# EAGLE design Zesilovač (EAGLE 8.6.1)
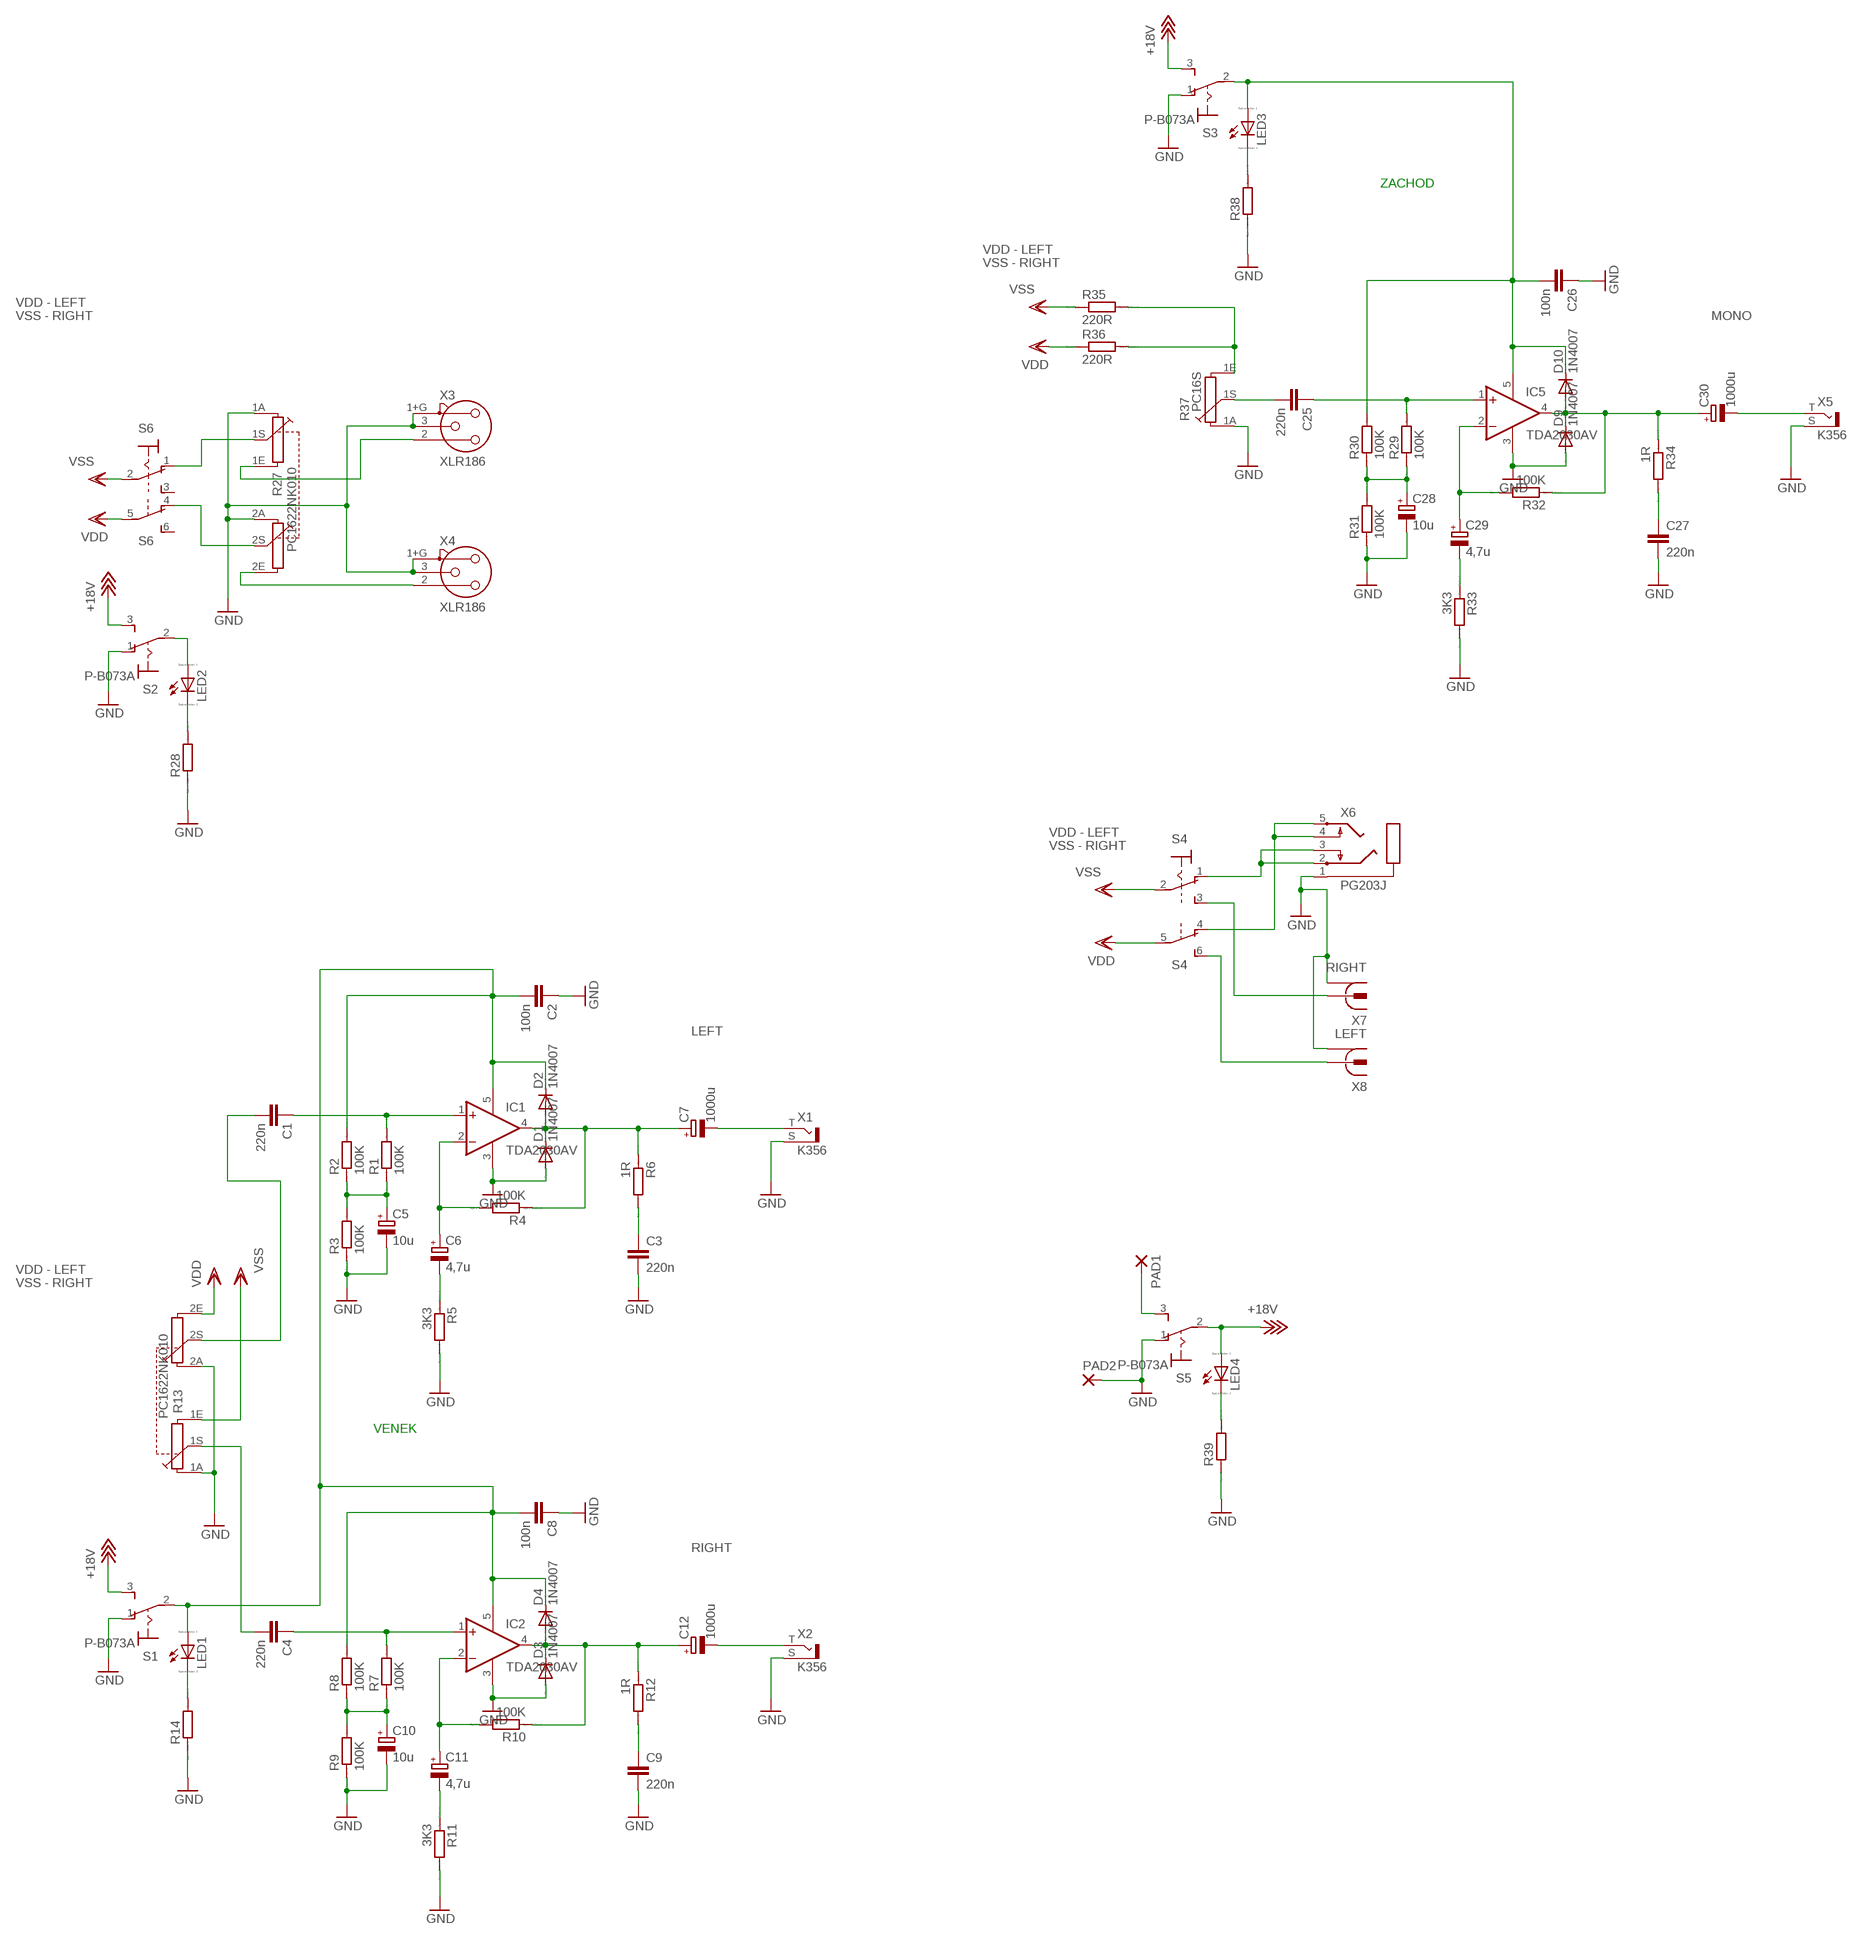
[diagram p0: schematic, sheet 1]

## Parts
C1  220n  C5/2.5  [C5B2.5]
C2  100n  C5/2.5  [C5B2.5]
C3  220n  C5/2.5  [C5B2.5]
C4  220n  C5/2.5  [C5B2.5]
C5  10u  CPOL-EUE2-4  [E2-4]
C6  4,7u  CPOL-EUE2.5-6  [E2,5-6]
C7  1000u  CPOL-EUE3.5-8  [E3,5-8]
C8  100n  C5/2.5  [C5B2.5]
C9  220n  C5/2.5  [C5B2.5]
C10  10u  CPOL-EUE2-4  [E2-4]
C11  4,7u  CPOL-EUE2.5-6  [E2,5-6]
C12  1000u  CPOL-EUE3.5-8  [E3,5-8]
C25  220n  C5/2.5  [C5B2.5]
C26  100n  C5/2.5  [C5B2.5]
C27  220n  C5/2.5  [C5B2.5]
C28  10u  CPOL-EUE2-4  [E2-4]
C29  4,7u  CPOL-EUE2.5-6  [E2,5-6]
C30  1000u  CPOL-EUE3.5-8  [E3,5-8]
D1  1N4007  1N4004  [DO41-10]
D2  1N4007  1N4004  [DO41-10]
D3  1N4007  1N4004  [DO41-10]
D4  1N4007  1N4004  [DO41-10]
D9  1N4007  1N4004  [DO41-10]
D10  1N4007  1N4004  [DO41-10]
IC1  TDA2030AV  TDA2003V  [CB360]
IC2  TDA2030AV  TDA2003V  [CB360]
IC5  TDA2030AV  TDA2003V  [CB360]
LED1  LED_ELD260  [LED_LD260]
LED2  LED_ELD260  [LED_LD260]
LED3  LED_ELD260  [LED_LD260]
LED4  LED_ELD260  [LED_LD260]
PAD1  3,81/1,4  [3,81/1,4]
PAD2  3,81/1,4  [3,81/1,4]
R1  100K  R0204/7  [0204/7]
R2  100K  R0204/7  [0204/7]
R3  100K  R0204/7  [0204/7]
R4  100K  R0204/7  [0204/7]
R5  3K3  R0204/7  [0204/7]
R6  1R  R0207/10  [0207/10]
R7  100K  R0204/7  [0204/7]
R8  100K  R0204/7  [0204/7]
R9  100K  R0204/7  [0204/7]
R10  100K  R0204/7  [0204/7]
R11  3K3  R0204/7  [0204/7]
R12  1R  R0207/10  [0207/10]
R13  PC1622NK010  PC16D  [PC16D]
R14  R0204/7  [0204/7]
R27  PC1622NK010  PC16D  [PC16D]
R28  R0204/7  [0204/7]
R29  100K  R0204/7  [0204/7]
R30  100K  R0204/7  [0204/7]
R31  100K  R0204/7  [0204/7]
R32  100K  R0204/7  [0204/7]
R33  3K3  R0204/7  [0204/7]
R34  1R  R0207/10  [0207/10]
R35  220R  R0204/7  [0204/7]
R36  220R  R0204/7  [0204/7]
R37  PC16S  [PC16S]
R38  R0204/7  [0204/7]
R39  R0204/7  [0204/7]
S1  P-B073A  320-916  [320-916]
S2  P-B073A  320-916  [320-916]
S3  P-B073A  320-916  [320-916]
S4  320-938  [320-938]
S5  P-B073A  320-916  [320-916]
S6  320-938  [320-938]
X1  K356  RC-5231  [RC-5231]
X2  K356  RC-5231  [RC-5231]
X3  XLR186  MC3FAV1-0  [NC3FAV1-0]
X4  XLR186  MC3FAV1-0  [NC3FAV1-0]
X5  K356  RC-5231  [RC-5231]
X6  PG203J  [PG203J]
X7  RIGHT  736880-49  [736880-49]
X8  LEFT  736880-49  [736880-49]

## Nets
+18V: LED4.A S1.3(S) S2.3(S) S3.3(S) S5.2(P)
GND: C2.1 C3.2 C5.- C8.1 C9.2 C10.- C26.1 C27.2 C28.- D1.A D3.A D9.A IC1.3(GND) IC2.3(GND) IC5.3(GND) PAD2.1(P) R3.1 R5.2 R9.1 R11.2 R13.1A R13.2A R14.1 R27.1A R27.2A R28.1 R31.1 R33.2 R37.1A R38.1 R39.1 S1.1(O) S2.1(O) S3.1(O) S5.1(O) X1.S X2.S X3.1+G X3.3 X4.1+G X4.3 X5.S X6.1 X7.1 X7.1@1 X7.1@2 X8.1 X8.1@1 X8.1@2
N$1: C1.1 IC1.1(+IN) R1.2
N$2: C7.+ D1.C D2.A IC1.4(OUT) R4.1 R6.1
N$3: C5.+ R1.1 R2.1 R3.2
N$4: C4.1 IC2.1(+IN) R7.2
N$5: C6.- R5.1
N$6: C6.+ IC1.2(-IN) R4.2
N$7: C3.1 R6.2
N$8: C10.+ R7.1 R8.1 R9.2
N$9: C11.- R11.1
N$10: C11.+ IC2.2(-IN) R10.2
N$11: C12.+ D3.C D4.A IC2.4(OUT) R10.1 R12.1
N$12: C9.1 R12.2
N$13: C1.2 R13.2S
N$14: C4.2 R13.1S
N$15: R27.1S S6.1(1:O)
N$16: C25.2 R37.1S
N$17: R27.2S S6.4(B:O)
N$18: LED3.K(C) R38.2
N$19: C7.- X1.T
N$20: C12.- X2.T
N$21: LED1.K(C) R14.2
N$22: R27.1E X3.2
N$23: R27.2E X4.2
N$39: LED2.K(C) R28.2
N$40: C25.1 IC5.1(+IN) R29.2
N$41: C28.+ R29.1 R30.1 R31.2
N$42: C29.- R33.1
N$43: C29.+ IC5.2(-IN) R32.2
N$44: C30.+ D9.C D10.A IC5.4(OUT) R32.1 R34.1
N$45: C27.1 R34.2
N$46: R35.2 R36.2 R37.1E
N$47: S4.1(1:O) X6.2 X6.3
N$48: C30.- X5.T
N$49: PAD1.1(P) S5.3(S)
N$50: S4.4(B:O) X6.4 X6.5
N$54: S4.3(1:S) X7.2
N$55: S4.6(B:S) X8.2
N$57: LED4.K(C) R39.2
N$68: LED2.A S2.2(P)
VCC1: C2.2 C8.2 D2.C D4.C IC1.5(V+) IC2.5(V+) LED1.A R2.2 R8.2 S1.2(P)
VCC3: C26.2 D10.C IC5.5(V+) LED3.A R30.2 S3.2(P)
VDD: R13.2E R36.1 S4.5(B:P) S6.5(B:P)
VSS: R13.1E R35.1 S4.2(1:P) S6.2(1:P)
Unconnected: S6.3(1:S) S6.6(B:S)

## Notes on the sheet
- ZACHOD
- VDD - LEFT
- VSS - RIGHT
- VDD - LEFT
- VSS - RIGHT | MONO
- VDD - LEFT
- VSS - RIGHT
- LEFT
- VDD - LEFT
- VSS - RIGHT
- VENEK
- RIGHT

## Library data of the parts
C1-C4 C8 C9 C25-C27 = capacitor-wima:C: CAPACITOR naming: grid - package width
C5-C7 C10-C12 C28-C30 = rcl:CPOL-EU: POLARIZED CAPACITOR, European symbol; SPICEPREFIX: C
D1-D4 D9 D10 = diode:1N4004: DIODE general purpose rectifier, 1 A
IC1 IC2 IC5 = linear:TDA2003: AUDIO AMPLIFIER
LED1-LED4 = eagle-ltspice:LED_E: LED Source: http://www.osram.convergy.de Source: www.luxeon.com Source: www.kingbright.com; SPICEMODEL: NONE; SPICEPREFIX: D; SPICETYPE: diode
PAD1 PAD2 = wirepad:3,81/1,4: THROUGH-HOLE PAD
R1-R12 R14 R28-R36 R38 R39 = eagle-ltspice:R: RESISTOR, European symbol; SPICEMODEL: NONE; SPICEPREFIX: R
R13 R27 = piher:PC16D: POTENTIOMETER tandem carbon potentiometer, 16 mm, S3ROH; OC_FARNELL: 4453049; OC_NEWARK: unknown
R37 = piher:PC16S: POTENTIOMETER single carbon potentiometer, 16 mm, S3ROH; OC_FARNELL: 4452940; OC_NEWARK: unknown
S1-S3 S5 = switch:320-916: TOGGLE SWITCH distributor RS Components
S4 S6 = switch:320-938: TOGGLE SWITCH distributor RS Components
X1 X2 X5 = con-lumberg:RC-5231: RCA connectors according to JEITA RC-5231 RCA-Steckverbinder nach JEITA RC-5231 Source: RCA- Stecker 2poolig.pdf
X3 X4 = con-neutrik_ag:MC3?: Neutrik Audio Connector XLR SERIES Stereo 1/4" jack Source: www.neutrik.com/; OC_FARNELL: unknown; OC_NEWARK: unknown
X6 = con-hirschmann:PG203J: MIC/HEADPHONE JACK KS-S stereo microphone/headphone jack PG203JN (Schukat); OC_FARNELL: unknown; OC_NEWARK: unknown
X7 X8 = con-conrad:736880-49: Cinch Connector ( RCA Jack ) Cinch-Einbaukupplung 90º 72345 Vernickelt BKL Electronic Source: Conrad <http://www.conrad.de/ce/de/product/736880>

## Board
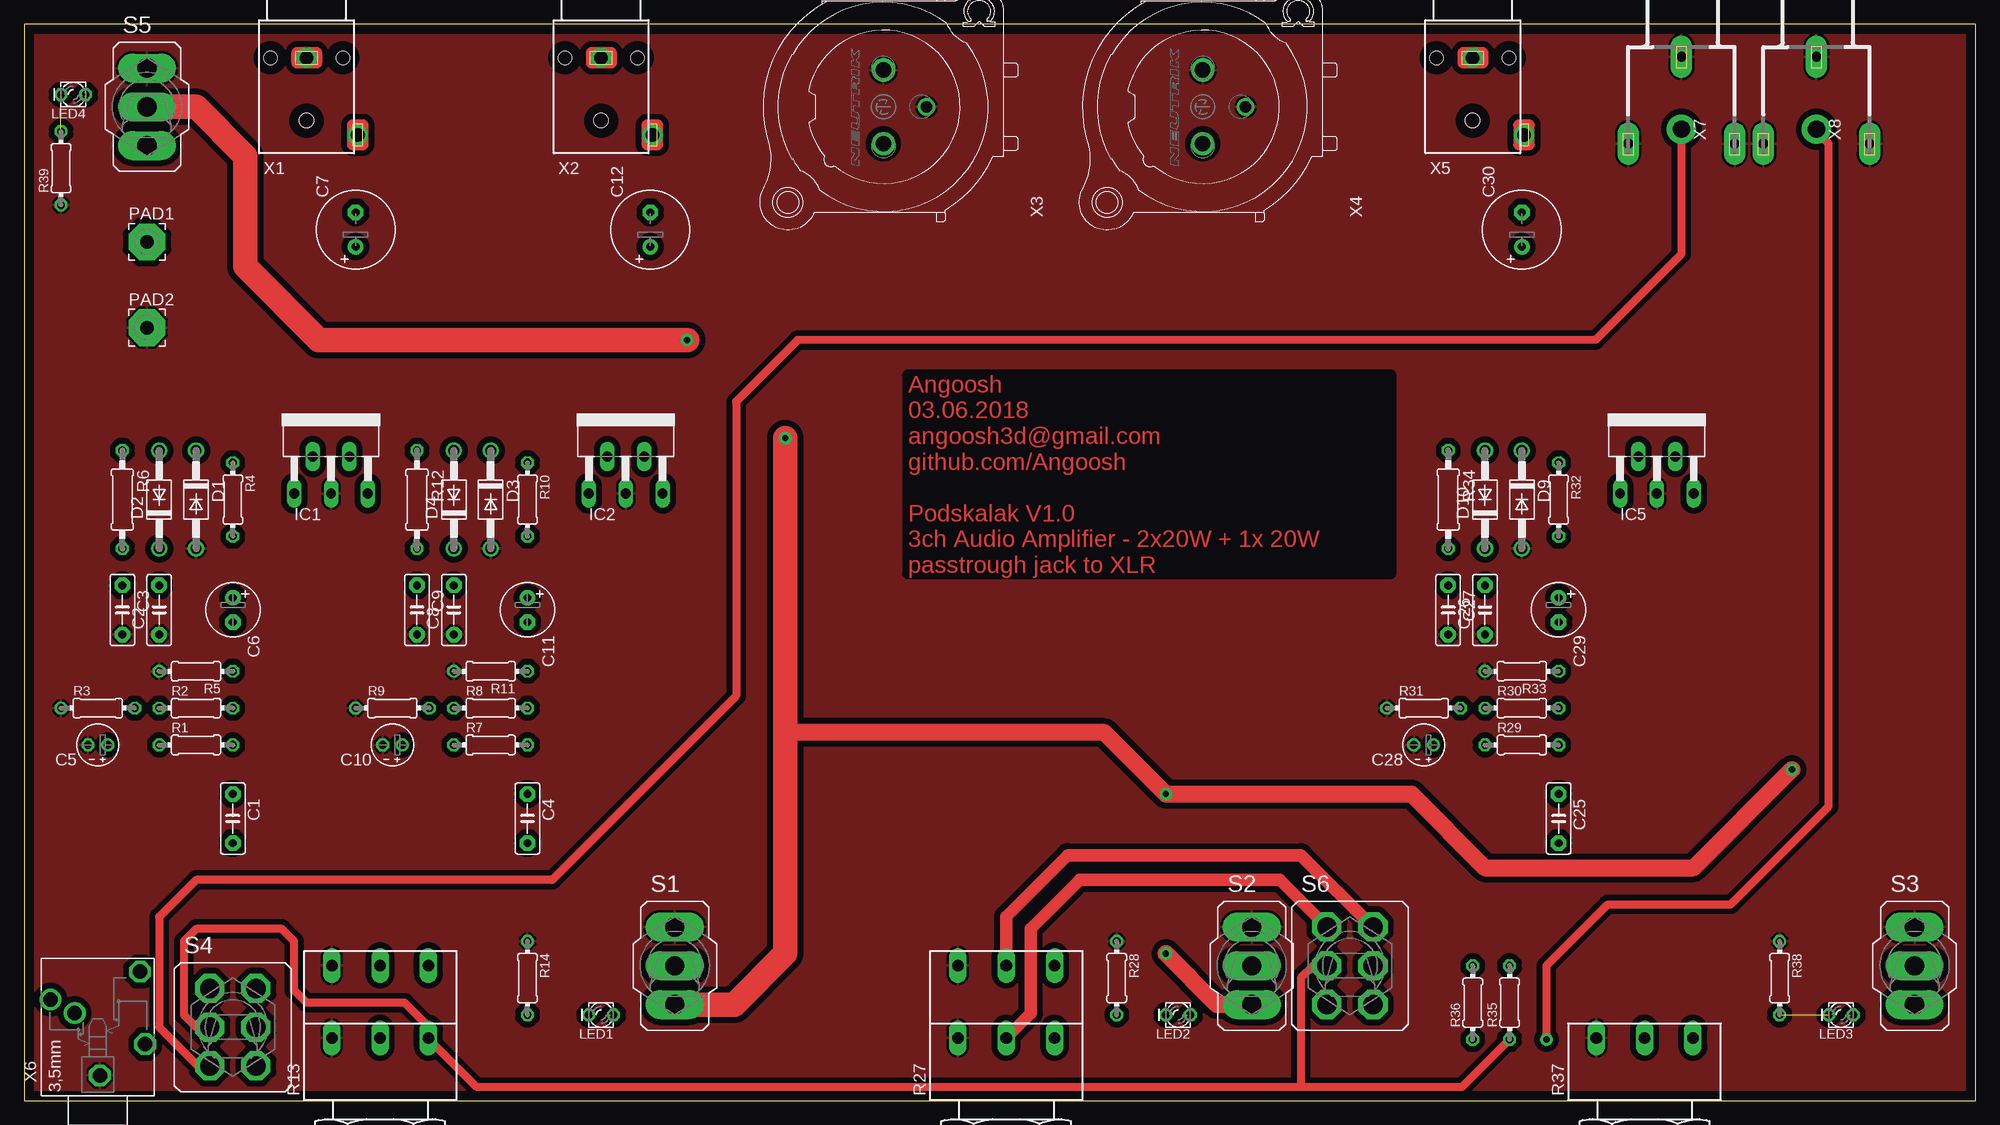
[diagram p1: board, top side]
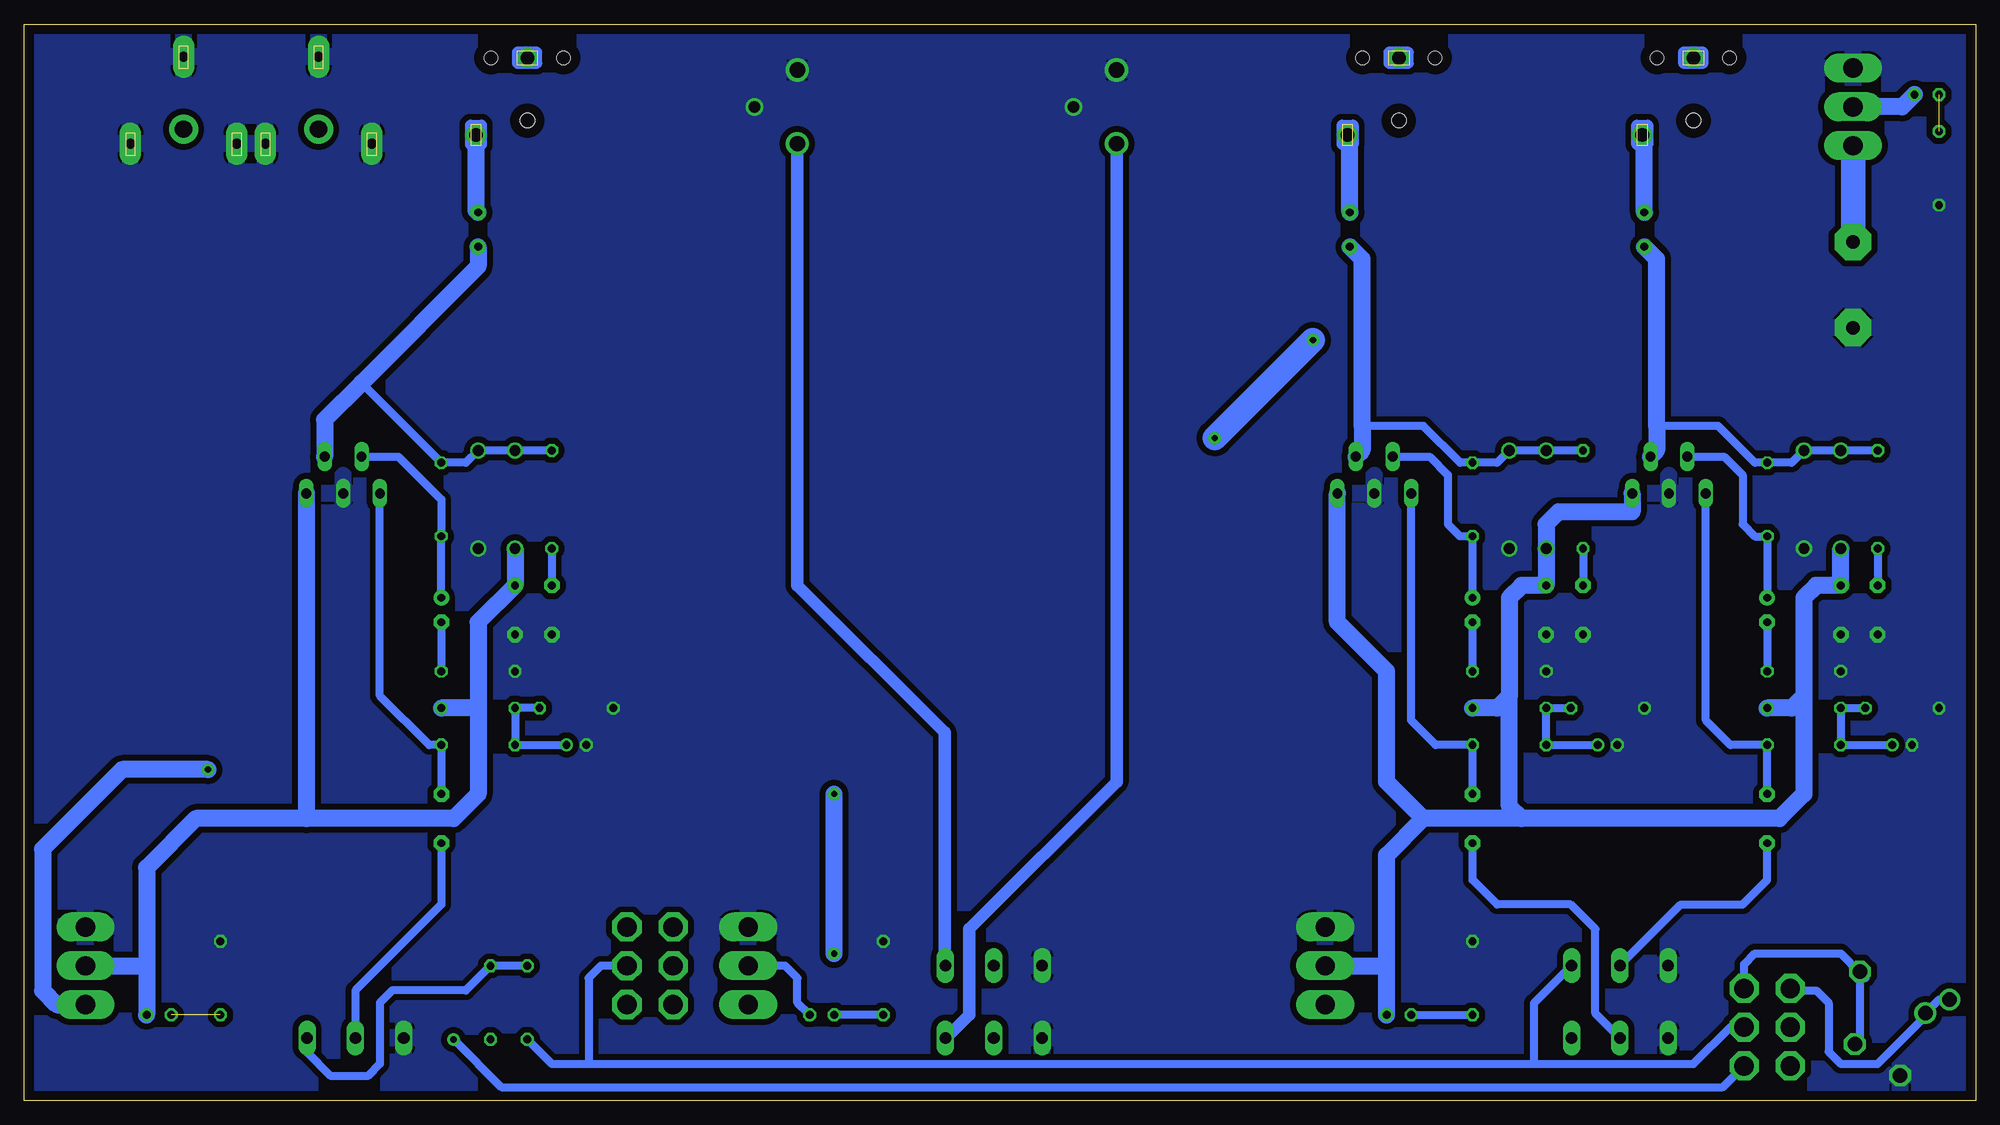
[diagram p2: board, bottom side, seen from below]

Size 201.91 x 111.43 mm. Coordinates in mm from the lower left corner, seen from the top.
Outline: 0,0 201.91,0 201.91,111.43 0,111.43 0,0
Copper layers (1*16): Top 0.035mm / dielectric 1.5mm / Bottom 0.035mm
Design rules "default": minimum track width 6mil, minimum drill 0.35mm, track to track 6mil, track to pad 6mil, pad to pad 6mil, via to via 6mil, smd to smd 6mil, copper to edge 40mil, drill to drill 6mil, minimum pad ring 10mil, minimum via ring 8mil, stop-mask expansion 4mil, vias tented up to drill 0mil, thermal gap 10mil

### Footprints (pad centres in the part's own frame; a part is rotated, then mirrored left to right if it is on the bottom)
C5B2.5 = drill 0.813 pad 1.6 octagon: 1 -2.54,0; 2 2.54,0
E2-4 = drill 0.813 pad 1.27: + -1.016,0 | drill 0.813 pad 1.27 octagon: - 1.016,0
E2,5-6 = drill 0.813 pad 1.6: + -1.27,0 | drill 0.813 pad 1.6 octagon: - 1.27,0
E3,5-8 = drill 0.813 pad 1.6: + -1.778,0 | drill 0.813 pad 1.6 octagon: - 1.778,0
DO41-10 = drill 1.118: A 5.08,0; C -5.08,0
CB360 = drill 1.016 long: 1 -3.81,-8.255; 2 -1.905,-4.445; 3 0,-8.255; 4 1.905,-4.445; 5 3.81,-8.255
LED_LD260 = drill 0.813 octagon: A -1.27,0; K 1.27,0
3,81/1,4 = drill 1.397 pad 3.81 octagon: 1 0,0
0204/7 = drill 0.813 octagon: 1 -3.81,0; 2 3.81,0
0207/10 = drill 0.813 octagon: 1 -5.08,0; 2 5.08,0
PC16D = drill 1.2 long: 1A -5,6.5; 1E 5,6.5; 1S 0,6.5; 2A -5,14; 2E 5,14; 2S 0,14
PC16S = drill 1.2 long: 1A -5,6.5; 1E 5,6.5; 1S 0,6.5
320-916 = drill 2.007 long: 1 0,4.013; 2 0,0; 3 0,-4.013
320-938 = drill 2.007 octagon: 1 -2.388,4.013; 2 -2.388,0; 3 -2.388,-4.013; 4 2.388,4.013; 5 2.388,0; 6 2.388,-4.013
RC-5231 = drill 1.4 pad 1.778: S 0,0; T 5.3,-8 | hole 1.4: -3.75,0; 3.75,0 | hole 1.5: 0,-6.5
NC3FAV1-0 = drill 1.6: 1+G 3.81,0; 2 -3.81,0 | drill 1.2: 3 0,-4.45
PG203J = drill 1.499 octagon: 1 -5.004,-0.203; 4 5.74,-4.369; 5 -1.753,-4.902 | drill 1.499: 2 2.845,4.902; 3 1.448,2.388
736880-49 = drill 1 pad 2.2 long: 1 -3.92,0; 1@1 5.08,-5.5; 1@2 5.08,5.5 | drill 1.8 pad 3: 2 3.58,0

### Placement (x,y rotation side)
C1  21.59,29.21 270 top
C2  13.97,50.8 90 top
C3  10.16,50.8 270 top
C4  52.07,29.21 270 top
C5  7.62,36.83 180 top
C6  21.59,50.8 270 top
C7  34.29,90.17 90 top
C8  44.45,50.8 90 top
C9  40.64,50.8 270 top
C10  38.1,36.83 180 top
C11  52.07,50.8 270 top
C12  64.77,90.17 90 top
C25  158.75,29.21 270 top
C26  151.13,50.8 90 top
C27  147.32,50.8 270 top
C28  144.78,36.83 180 top
C29  158.75,50.8 270 top
C30  154.94,90.17 90 top
D1  17.78,62.23 270 top
D2  13.97,62.23 90 top
D3  48.26,62.23 270 top
D4  44.45,62.23 90 top
D9  154.94,62.23 270 top
D10  151.13,62.23 90 top
IC1  31.75,71.12 0 top
IC2  62.23,71.12 0 top
IC5  168.91,71.12 0 top
LED1  59.69,8.89 180 top
LED2  119.38,8.89 180 top
LED3  187.96,8.89 180 top
LED4  5.08,104.14 180 top
PAD1  12.7,88.9 0 top
PAD2  12.7,80.01 0 top
R1  17.78,36.83 0 top
R2  17.78,40.64 0 top
R3  7.62,40.64 0 top
R4  21.59,62.23 270 top
R5  17.78,44.45 180 top
R6  10.16,62.23 270 top
R7  48.26,36.83 0 top
R8  48.26,40.64 0 top
R9  38.1,40.64 0 top
R10  52.07,62.23 270 top
R11  48.26,44.45 180 top
R12  40.64,62.23 270 top
R13  36.83,0 0 top
R14  52.07,12.7 270 top
R27  101.6,0 0 top
R28  113.03,12.7 270 top
R29  154.94,36.83 0 top
R30  154.94,40.64 0 top
R31  144.78,40.64 0 top
R32  158.75,62.23 270 top
R33  154.94,44.45 180 top
R34  147.32,62.23 270 top
R35  153.67,10.16 90 top
R36  149.86,10.16 90 top
R37  167.64,0 0 top
R38  181.61,12.7 270 top
R39  3.81,96.52 90 top
S1  67.31,13.97 0 top
S2  127,13.97 0 top
S3  195.58,13.97 0 top
S4  21.59,7.62 0 top
S5  12.7,102.87 0 top
S6  137.16,13.97 0 top
X1  29.21,107.95 0 top
X2  59.69,107.95 0 top
X3  88.9,102.87 90 top
X4  121.92,102.87 90 top
X5  149.86,107.95 0 top
X6  7.62,7.62 90 top
X7  171.45,104.14 270 top
X8  185.42,104.14 270 top

### Tracks (layer width: path | path; a pad name or v marks a point on that pad's centre or on a via)
+18V  (via drill 0.65 pad 1.3)
  Top 1.778: S2.3 123.39,9.96 v118.11,15.24 | 78.74,38.1 111.76,38.1 v118.11,31.75 143.51,31.75 151.13,24.13 172.72,24.13 v182.88,34.29
  Top 2.54: S5.2 17.78,102.87 22.86,97.79 22.86,86.36 30.48,78.74 v68.58,78.74 | v78.74,68.58 78.74,38.1 78.74,15.24 73.46,9.96 S1.3
  Bottom 1.778: LED4.A 7.62,102.87 S5.2 | v118.11,15.24 v118.11,31.75 | v182.88,34.29 191.77,34.29 200,26.05 200,11.43 198.53,9.96 S3.3
  Bottom 2.54: v68.58,78.74 v78.74,68.58
GND
  pour Bottom (isolate 0.61): 0,111.76 0,0 201.93,0 201.93,111.76
  pour Top (isolate 0.61): 0,111.76 0,0 201.93,0 201.93,111.76
N$1
  Bottom 0.813: C1.1 R1.2 25.4,36.83 27.94,39.37 IC1.1
N$2
  Bottom 0.813: R6.1 D2.A D1.C 19.05,66.04 R4.1 22.86,66.04 26.67,69.85 33.02,69.85
  Bottom 1.778: IC1.4 33.02,67.31 33.02,69.85 33.02,87.12 C7.+
N$3
  Bottom 0.813: R3.2 R2.1 R1.1 C5.+
N$4
  Bottom 0.813: C4.1 R7.2 55.88,36.83 58.42,39.37 IC2.1
N$5
  Bottom 0.813: C6.- R5.1
N$6
  Bottom 0.813: IC1.2 26.04,66.67 24.13,64.77 24.13,59.69 22.86,58.42 R4.2 C6.+
N$7
  Bottom 0.813: R6.2 C3.1
N$8
  Bottom 0.813: C10.+ R7.1 R8.1 R9.2
N$9
  Bottom 0.813: R11.1 C11.-
N$10
  Bottom 0.813: C11.+ R10.2 53.34,58.42 54.61,59.69 54.61,64.77 56.52,66.67 IC2.2
N$11
  Bottom 0.813: R12.1 D4.A D3.C 49.53,66.04 R10.1 53.34,66.04 57.15,69.85 63.5,69.85
  Bottom 1.778: IC2.4 63.5,67.31 63.5,69.85 63.5,87.12 C12.+
N$12
  Bottom 0.813: R12.2 C9.1
N$13
  Bottom 0.813: R13.2S 30.51,20.32 24.13,20.32 21.59,22.86 C1.2
N$14
  Bottom 0.813: R13.1S 39.37,9.04 39.37,17.78 41.91,20.32 49.53,20.32 52.07,22.86 C4.2
N$15
  Top 1.27: R27.1S 104.14,9.04 104.14,17.78 109.22,22.86 129.9,22.86 S6.1
N$16
  Bottom 0.813: C25.2 158.75,20.32 167.64,11.43 R37.1S 167.64,6.35
N$17
  Top 1.27: R27.2S 101.6,19.05 107.95,25.4 132.08,25.4 139.5,17.98 S6.4
N$18  (1 unrouted)
N$19
  Bottom 1.778: C7.- 34.29,99.73 X1.T
N$20
  Bottom 1.778: C12.- 64.77,99.73 X2.T
N$21
  Bottom 0.813: LED1.K R14.2
N$22
  Bottom 1.27: X3.2 88.9,33.02 104.14,17.78 104.14,8.89 106.53,6.5 R27.1E
N$23
  Bottom 1.27: X4.2 121.92,53.34 106.68,38.1 106.68,13.97 106.63,13.97 R27.2E
N$39
  Bottom 0.813: R28.2 LED2.K
N$40
  Bottom 0.813: C25.1 R29.2 160.02,36.83 165.1,41.91 IC5.1
N$41
  Bottom 0.813: R31.2 R30.1 R29.1 C28.+
N$42
  Bottom 0.813: C29.- R33.1
N$43
  Bottom 0.813: C29.+ R32.2 158.75,62.23 163.19,66.67 IC5.2
N$44
  Bottom 0.813: R34.1 D10.A D9.C 156.21,66.04 R32.1 167,74.3
  Bottom 1.778: C30.+ 154.94,86.36 167,74.3 170.81,70.48 IC5.4
N$45
  Bottom 0.813: R34.2 C27.1
N$46
  Bottom 0.813: R36.2 R35.2 156.21,11.43 163.83,11.43 165.1,10.16 165.1,3.81 166.37,2.54 170.18,2.54 172.64,5 R37.1E
N$47
  Bottom 0.813: S4.1 19,11.43 16.51,11.43 15.24,10.16 15.24,5.08 13.97,3.81 10.16,3.81 5.23,8.74 X6.3 3.83,10.46 X6.2
N$48
  Bottom 1.778: C30.- 155.16,92.17 X5.T
N$49
  Bottom 2.54: PAD1.1 S5.3
N$50
  Bottom 0.813: S4.4 23.98,14.12 22.86,15.24 13.97,15.24 11.99,13.26 | 11.43,12.7 11.99,13.26 | 11.99,13.26 X6.4 11.99,6.4 X6.5
N$54
  Top 0.813: X7.2 171.45,87.63 162.56,78.74 80.01,78.74 73.66,72.39 73.66,41.91 54.61,22.86 17.78,22.86 13.97,19.05 13.97,7.62 17.98,3.61 S4.3
N$55  (via drill 0.65 pad 1.3)
  Top 0.813: X8.2 185.42,100.33 186.69,99.06 186.69,30.48 176.53,20.32 163.83,20.32 157.48,13.97 v157.48,6.35
  Bottom 0.813: v157.48,6.35 152.55,1.42 26.16,1.42 S4.6
N$57  (1 unrouted)
N$68
  Bottom 0.813: LED2.A 121.92,10.16 121.92,12.7 123.19,13.97 S2.2
VCC1
  Bottom 1.778: IC1.5 35.56,60.96 43.18,60.96 44.45,59.69 D4.C C8.2 46.99,53.34 48.26,52.07 48.26,41.91 | 48.26,41.91 49.53,40.64 R8.2 | D2.C C2.2 16.51,53.34 17.78,52.07 17.78,41.91 | 17.78,41.91 19.05,40.64 R2.2 | 17.78,41.91 17.78,31.75 20.32,29.21 46.99,29.21 | 46.99,29.21 48.26,30.48 48.26,41.91 | 46.99,29.21 57.15,29.21 | 57.15,29.21 60.96,25.4 60.96,13.97 | LED1.A 60.96,13.97 | 57.15,29.21 60.96,33.02 60.96,44.45 66.04,49.53 IC2.5 | S1.2 60.96,13.97
VCC3
  Bottom 1.778: D10.C C26.2 154.94,49.53 154.94,40.64 | 154.94,40.64 R30.2 | 154.94,40.64 154.94,31.75 157.48,29.21 172.72,29.21 | 172.72,29.21 184.15,29.21 189.23,24.13 189.23,13.97 | 189.23,13.97 LED3.A | S3.2 189.23,13.97 | IC5.5 172.72,29.21
VDD
  Bottom 0.813: R36.1 147.32,3.81 143.51,3.81 | S4.5 25.4,7.62 29.21,3.81 45.72,3.81 | 143.51,3.81 45.72,3.81 | S6.5 142.24,13.97 143.51,12.7 143.51,3.81 | R13.2E 45.72,10.11 45.72,3.81
VSS
  Top 0.813: R35.1 148.74,1.42 132.08,1.42 | 132.08,1.42 46.84,1.42 41.83,6.43 R13.1E 41.83,7.7 39.37,10.16 29.21,10.16 27.94,11.43 27.94,16.51 26.67,17.78 17.78,17.78 16.51,16.51 16.51,8.89 17.78,7.62 S4.2 | S6.2 133.35,13.97 132.08,12.7 132.08,1.42

### Text on the board
Top: Angoosh / 03.06.2018 / angoosh3d@gmail.com / github.com/Angoosh / / Podskalak V1.0 / 3ch Audio Amplifier - 2x20W + 1x 20W / passtrough jack to XLR